# Altium project Universal driver v2.PrjPcb
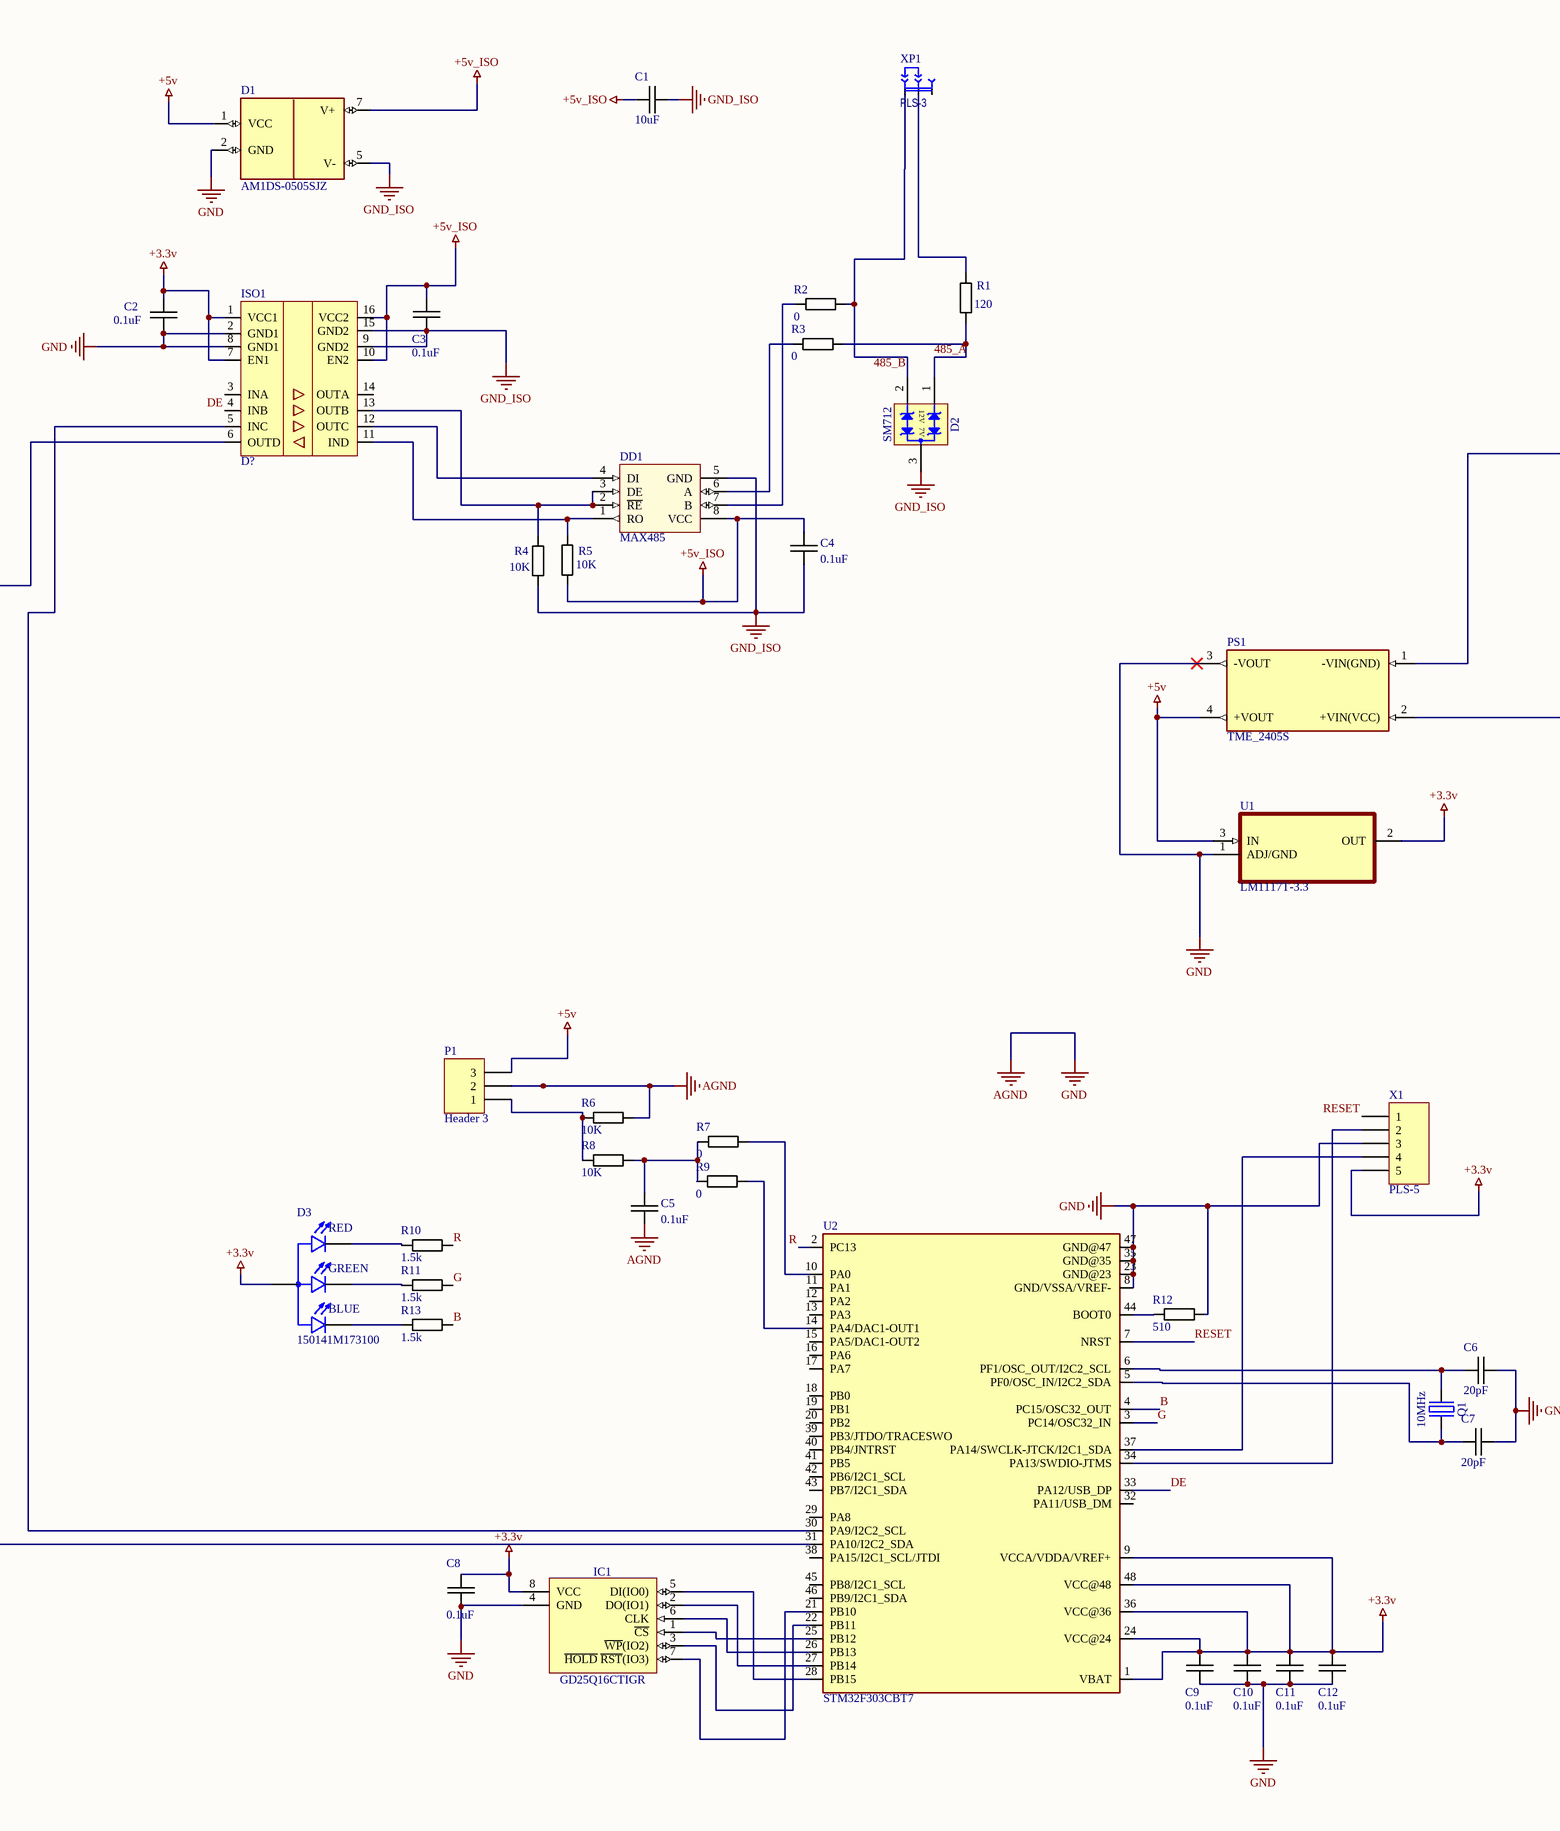
[diagram p0: universal driver v2.SchDoc, left]
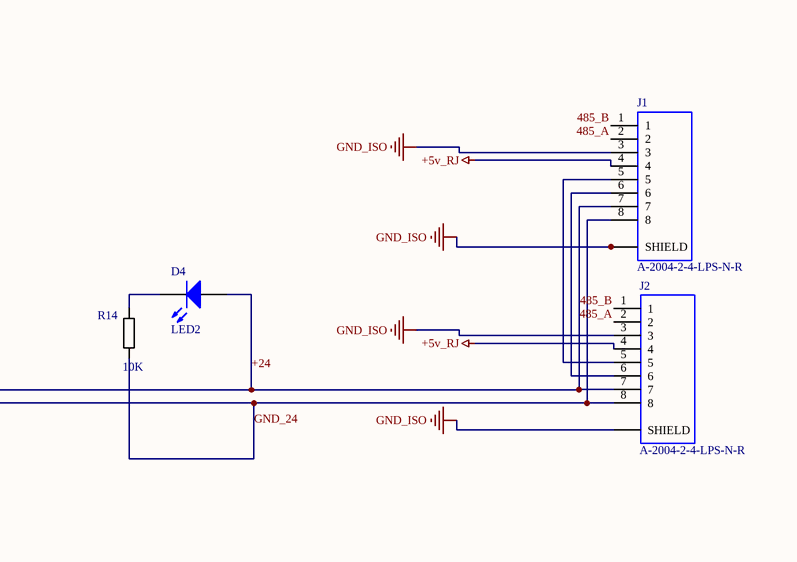
[diagram p1: universal driver v2.SchDoc, right]
1 sheet, 42 parts. Net scope: global (net labels, ports and power ports of the same name join across sheets).
Board file: Universal_Driver v2.PcbDoc

## Sheet universal driver v2.SchDoc
size A1

### Parts
C1  10uF  [CAPC3225X270N]
C2  0.1uF  [CAPACITOR 0603]
C3  0.1uF  [CAPACITOR 0603]
C4  0.1uF  [CAPACITOR 0603]
C5  0.1uF  [CAPACITOR 0603]
C6  20pF  [CAPACITOR 0603]
C7  20pF  [CAPACITOR 0603]
C8  0.1uF  [CAPACITOR 0603]
C9  0.1uF  [CAPACITOR 0603]
C10  0.1uF  [CAPACITOR 0603]
C11  0.1uF  [CAPACITOR 0603]
C12  0.1uF  [CAPACITOR 0603]
D1  AM1DS-0505SJZ  [AM2D-NZ]
D2  SM712  [SOT23]
D3  150141M173100  [LED_150141M173100]
D4  LED2  [3.2X1.6X1.1]
DD1  MAX485  [NSO8]
IC1  GD25Q16CTIGR  [NSO8]
ISO1  D?  [*SOIC127P1030X265-16N]
J1  A-2004-2-4-LPS-N-R  [ASSMANN_A-2004-2-4-LPS-N-R]
J2  A-2004-2-4-LPS-N-R  [ASSMANN_A-2004-2-4-LPS-N-R]
P1  Header 3  [HDR1X3]
PS1  TME_2405S  [CONV_TME_2405S]
Q1  10MHz  [HC49SM]
R1  120  [Resistor 0805]
R2  0  [Resistor 0805]
R3  0  [Resistor 0805]
R4  10K  [Resistor 0805]
R5  10K  [Resistor 0805]
R6  10K  [Resistor 0805]
R7  0  [Resistor 0805]
R8  10K  [Resistor 0805]
R9  0  [Resistor 0805]
R10  1.5k  [Resistor 0805]
R11  1.5k  [Resistor 0805]
R12  510  [Resistor 0805]
R13  1.5k  [Resistor 0805]
R14  10K  [Resistor 0805]
U1  LM1117T-3.3  [TO-220-KCS0003B]
U2  STM32F303CBT7  [LQFP48]
X1  PLS-5  [PLS-5-3D]
XP1  PLS-3  [ZL201-3]

### Nets
+3.3v: C2.1 C8.1 C9.2 C10.2 C11.2 C12.2 D3.1(A) IC1.8(VCC) ISO1.1(VCC1) ISO1.7(EN1) U1.2(OUT) U2.1(VBAT) U2.9(VCCA/VDDA/VREF+) U2.24(VCC@24) U2.36(VCC@36) U2.48(VCC@48) X1.5
+5v: D1.1(VCC) P1.3 PS1.4(+VOUT) U1.3(IN)
+5v_ISO: C1.2 C3.2 C4.2 D1.7(V+) DD1.8(VCC) ISO1.10(EN2) ISO1.16(VCC2) R5.1
+5v_RJ: J1.4 J2.4
AGND: C2.2 C5.1 C6.1 C7.1 C8.2 C9.1 C10.1 C11.1 C12.1 D1.2(GND) IC1.4(GND) ISO1.2(GND1) ISO1.8(GND1) P1.2 PS1.3(-VOUT) R6.1 R12.2 U1.1(ADJ/GND) U2.8(GND/VSSA/VREF-) U2.23(GND@23) U2.35(GND@35) U2.47(GND@47) X1.3  [also labelled GND]
GND_ISO: C1.1 C3.1 C4.1 D1.5(V-) D2.3(GND) DD1.5(GND) ISO1.9(GND2) ISO1.15(GND2) J1.3 J1.S1(SHIELD) J1.S2(SHIELD) J2.3 J2.S1(SHIELD) J2.S2(SHIELD) R4.2
485_A: D2.1(I/O1) J1.2 J2.2 R1.2 R3.1
485_B: D2.2(I/O2) J1.1 J2.1 R2.1 XP1.1
+24: D4.1(A) J1.7 J2.7 PS1.2(+VIN(VCC))
B: R13.1 U2.4(PC15/OSC32_OUT)
DE: ISO1.4(INB) U2.33(PA12/USB_DP)
G: R11.1 U2.3(PC14/OSC32_IN)
GND_24: J1.8 J2.8 PS1.1(-VIN(GND)) R14.2
R: R10.1 U2.2(PC13)
RESET: U2.7(NRST) X1.1
NetC5_2: C5.2 R7.2 R8.1 R9.2
NetC6_2: C6.2 Q1.1(OSC1) U2.6(PF1/OSC_OUT/I2C2_SCL)
NetC7_2: C7.2 Q1.2(OSC2) U2.5(PF0/OSC_IN/I2C2_SDA)
NetD3_2: D3.2(B_C) R13.2
NetD3_3: D3.3(R_C) R10.2
NetD3_4: D3.4(G_C) R11.2
NetD4_2: D4.2(K) R14.1
NetDD1_1: DD1.1(RO) ISO1.11(IND) R5.2
NetDD1_2: DD1.2(~{RE}) DD1.3(DE) ISO1.13(OUTB) R4.1
NetDD1_4: DD1.4(DI) ISO1.12(OUTC)
NetDD1_6: DD1.6(A) R3.2
NetDD1_7: DD1.7(B) R2.2
NetIC1_1: IC1.1(~{CS}) U2.25(PB12)
NetIC1_2: IC1.2(DO(IO1)) U2.27(PB14)
NetIC1_3: IC1.3(~{WP}(IO2)) U2.22(PB11)
NetIC1_5: IC1.5(DI(IO0)) U2.28(PB15)
NetIC1_6: IC1.6(CLK) U2.26(PB13)
NetIC1_7: IC1.7(~{HOLD}_~{RST}(IO3)) U2.21(PB10)
NetISO1_5: ISO1.5(INC) U2.30(PA9/I2C2_SCL)
NetISO1_6: ISO1.6(OUTD) U2.31(PA10/I2C2_SDA)
NetJ1_5: J1.5 J2.5
NetJ1_6: J1.6 J2.6
NetP1_1: P1.1 R6.2 R8.2
NetR1_1: R1.1 XP1.2
NetR7_1: R7.1 U2.10(PA0)
NetR9_1: R9.1 U2.14(PA4/DAC1-OUT1)
NetR12_1: R12.1 U2.44(BOOT0)
NetU2_34: U2.34(PA13/SWDIO-JTMS) X1.2
NetU2_37: U2.37(PA14/SWCLK-JTCK/I2C1_SDA) X1.4

Not connected (* = marked no-connect by the designer): ISO1 3(INA) 14(OUTA); U2 11(PA1) 12(PA2) 13(PA3) 15(PA5/DAC1-OUT2) 16(PA6) 17(PA7) 18(PB0) 19(PB1) 20(PB2) 29(PA8) 32(PA11/USB_DM) 38(PA15/I2C1_SCL/JTDI) 39(PB3/JTDO/TRACESWO) 40(PB4/JNTRST) 41(PB5) 42(PB6/I2C1_SCL) 43(PB7/I2C1_SDA) 45(PB8/I2C1_SCL) 46(PB9/I2C1_SDA); XP1 3

### Notes on the sheet
- (in symbol 150141M173100) RED; GREEN; BLUE
- (in symbol SM712) 12V; 7V

### Library data of the parts
C1-C12 = Capasitor: Value: *
D2 = SM712: Asymmetrical TVS Diode for Extended Common-Mode RS-485
D3 = 150141M173100: Red, Green, Blue _RGB_ 625nm Red, 520nm Green, 470nm Blue LED Indication - Discrete 2V Red, 3.2V Green, 3.2V Blue 1411 _3528 Metric_; MF: Wurth Electronics; SnapEDA_Link: https://www.snapeda.com/parts/150141M173100/Wurth%20Electronics%20Inc./view-part/281733/?ref=snap; Price: None; MP: 150141M173100; Package: 1411 WÃ¼rth Elektronik; Value: *; Availability: Unavailable
D4 = LED2: Typical RED, GREEN, YELLOW, AMBER GaAs LED; Published: 8-Jun-2000; LatestRevisionDate: 17-Jul-2002; LatestRevisionNote: Re-released for DXP Platform.; PackageVersion: Feb-2002; PackageReference: 3.2X1.6X1.1; Publisher: Altium Limited; PackageDescription: SM LED; 2 Flat Leads
DD1 = MAX485: Low-Power, Slew-Rate-Limited RS-485/RS-422 Transceiver; ComponentLink1URL: http://pdfserv.maxim-ic.com/en/ds/MAX1487-MAX491.pdf; Type: MAX485
IC1 = W25Q128FVEIG: 128M-bit Serial Flash Memory with uniform 4KB sectors and Dual/Quad SPI and QPI
ISO1 = ISO7341
J1 J2 = A-2004-2-4-LPS-N-R: Jack Modular Connector 8p8c _RJ45, Ethernet_ 90Â° Angle _Right_ Shielded; MF: Assmann WSW; Package: None; MP: A-2004-2-4-LPS-N-R; Value: *; Price: None; Availability: Unavailable; SnapEDA_Link: https://www.snapeda.com/parts/A-2004-2-4-LPS-N-R/Assmann%20WSW%20Components/view-part/454861/?ref=snap
P1 = Header 3: Header, 3-Pin; LatestRevisionDate: 17-Jul-2002; LatestRevisionNote: Re-released for DXP Platform.; Publisher: Altium Limited
PS1 = TME_2405S: 1 Watt DC/DC converter, industrial, 10% input, unregulated, encapsulated, SIP-4 package; MF: Traco Power; MP: TME 2405S; Price: None; SnapEDA_Link: https://www.snapeda.com/parts/TME%202405S/Traco%20Power/view-part/488335/?ref=snap; Availability: In Stock; Value: *; Check_prices: https://www.snapeda.com/parts/TME%202405S/Traco%20Power/view-part/488335/?ref=eda; Package: SIP-4 Traco Power
Q1 = Quartz Crystal
R1-R14 = Resistor: Value: *
U1 = LM1117T-3.3: Linear Voltage Regulator IC 1 Output 800mA TO-220-3; MF: Texas Instruments; MP: LM1117T-3.3; Price: None; Availability: Unavailable; Package: TO-220 Texas Instruments; SnapEDA_Link: https://www.snapeda.com/parts/LM1117T-3.3/Texas%20Instruments/view-part/103788/?ref=snap; Value: *
U2 = STM32F303CBT7: ARMÂ® CortexÂ®-M4 STM32F3 Microcontroller IC 32-Bit 72MHz 128KB _128K x 8_ FLASH 48-LQFP _7x7_; MF: STMicroelectronics; MP: STM32F303CBT7; SnapEDA_Link: https://www.snapeda.com/parts/STM32F303CBT7/STMicroelectronics/view-part/560080/?ref=snap; Value: *; Package: LQFP-48 STMicroelectronics; Price: None; Availability: Unavailable
X1 = PLS-5: Header, 5-Pin; LatestRevisionDate: 17-Jul-2002; LatestRevisionNote: Re-released for DXP Platform.; Publisher: Altium Limited
XP1 = Select jump: Connector, 3-Pin; Class: Электронные компоненты; SubClass: Разъемы; Pitch_mm: {Pitch_mm}; Installation: DIP; Ordering_Information: {Ordering_Information}; Type_of_connector: {Type_of_connector}; Pins: 3; Value: PLS-3